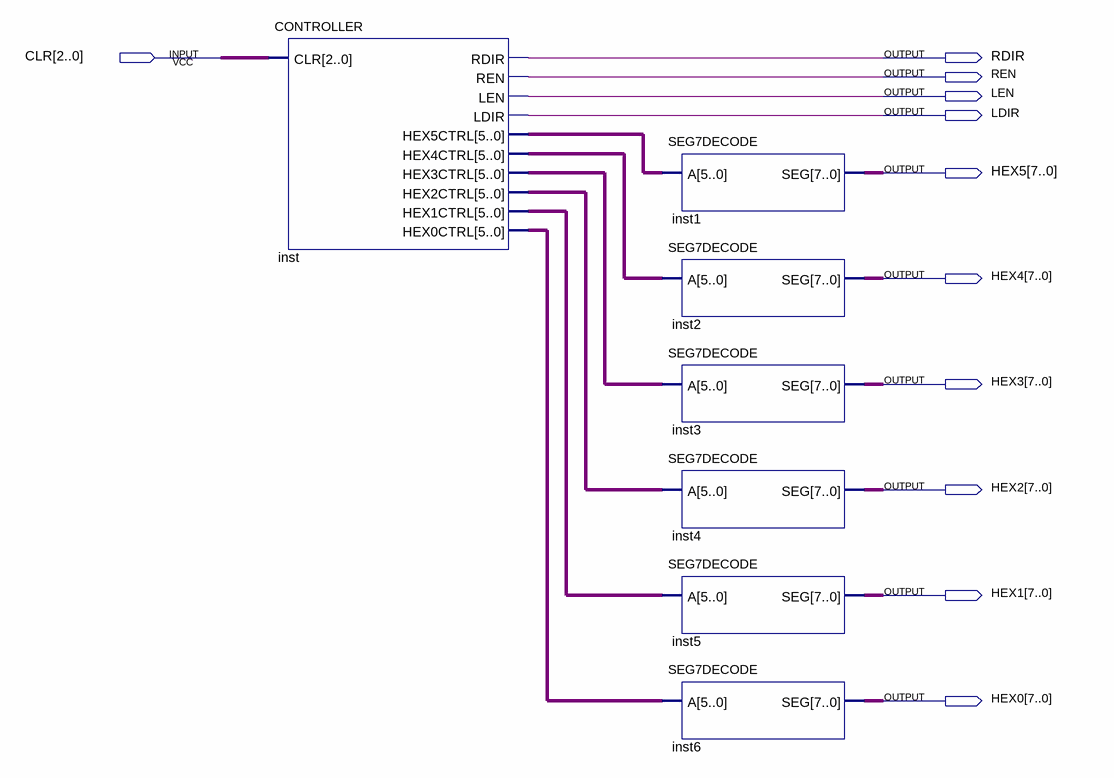
[diagram p0: schematic sheet]
// Quartus schematic digibot7segvhdl.bdf as structural Verilog: 7 symbols, 11 pins
module digibot7segvhdl (
  input  [2:0] CLR,
  output RDIR,
  output REN,
  output LEN,
  output LDIR,
  output [7:0] HEX5,
  output [7:0] HEX4,
  output [7:0] HEX3,
  output [7:0] HEX2,
  output [7:0] HEX1,
  output [7:0] HEX0
);

  wire [5:0] inst_hex0ctrl, inst_hex1ctrl, inst_hex2ctrl, inst_hex3ctrl, inst_hex4ctrl, inst_hex5ctrl;

  CONTROLLER inst (
    .CLR(CLR), .RDIR(RDIR), .REN(REN), .LEN(LEN), .LDIR(LDIR), .HEX5CTRL(inst_hex5ctrl),
    .HEX4CTRL(inst_hex4ctrl), .HEX3CTRL(inst_hex3ctrl), .HEX2CTRL(inst_hex2ctrl), .HEX1CTRL(inst_hex1ctrl),
    .HEX0CTRL(inst_hex0ctrl));
  SEG7DECODE inst1 (.A(inst_hex5ctrl), .SEG(HEX5));
  SEG7DECODE inst2 (.A(inst_hex4ctrl), .SEG(HEX4));
  SEG7DECODE inst3 (.A(inst_hex3ctrl), .SEG(HEX3));
  SEG7DECODE inst4 (.A(inst_hex2ctrl), .SEG(HEX2));
  SEG7DECODE inst5 (.A(inst_hex1ctrl), .SEG(HEX1));
  SEG7DECODE inst6 (.A(inst_hex0ctrl), .SEG(HEX0));
endmodule
